# EAGLE schematic cansat_vehicle (EAGLE 7.1.0)
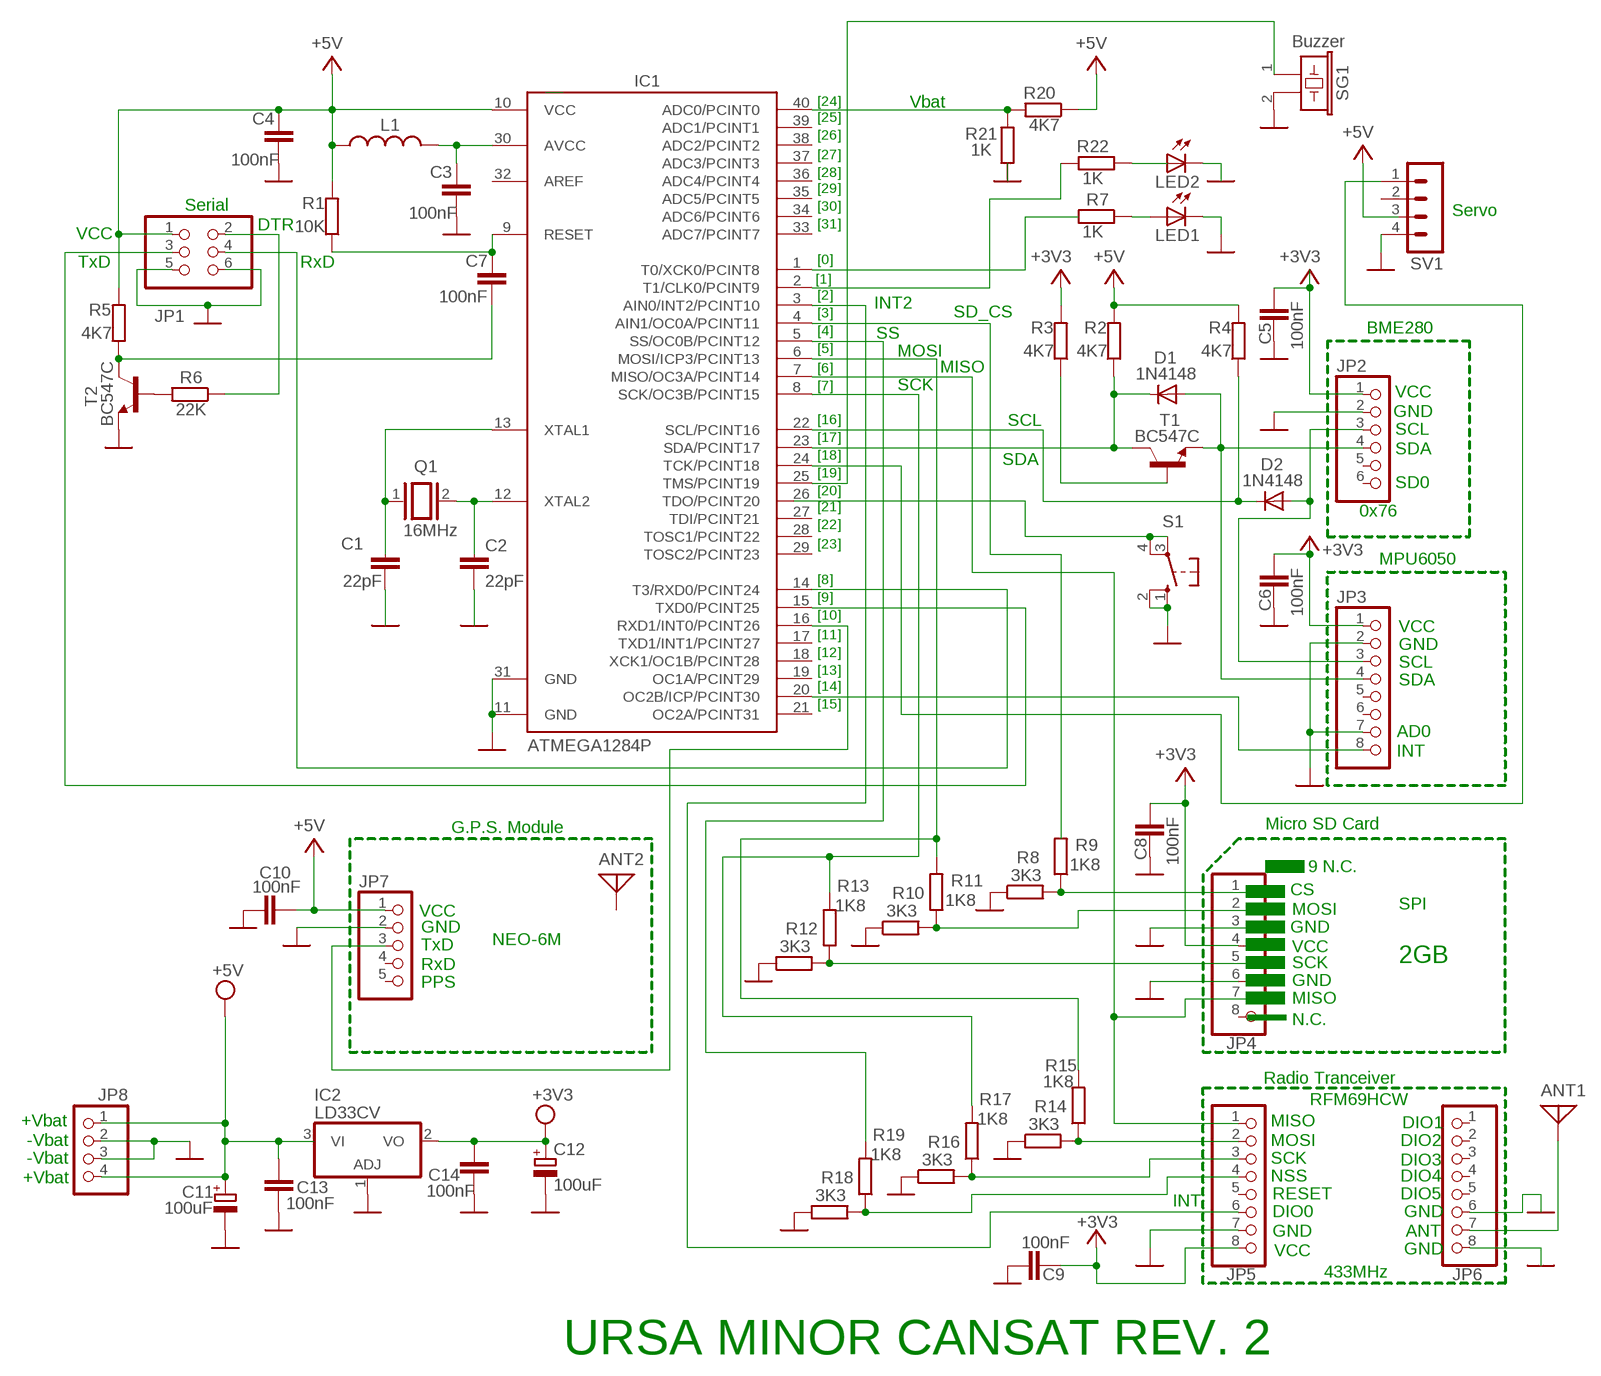
[diagram p0: schematic, sheet 1]

## Parts
ANT1  ANTENNA  [PAD-01]
ANT2  ANTENNA  [PAD-01]
C1  22pF  C2.5/2  [C2.5-2]
C2  22pF  C2.5/2  [C2.5-2]
C3  100nF  C2.5/2  [C2.5-2]
C4  100nF  C2.5/2  [C2.5-2]
C5  100nF  C2.5/2  [C2.5-2]
C6  100nF  C2.5/2  [C2.5-2]
C7  100nF  C2.5/2  [C2.5-2]
C8  100nF  C2.5/2  [C2.5-2]
C9  100nF  C2.5/2  [C2.5-2]
C10  100nF  C2.5/2  [C2.5-2]
C11  100uF  CPOL-EUE2.5-7  [E2,5-7]
C12  100uF  CPOL-EUE2.5-7  [E2,5-7]
C13  100nF  C2.5/2  [C2.5-2]
C14  100nF  C2.5/2  [C2.5-2]
D1  1N4148  1N4148DO35-10  [DO35-10]
D2  1N4148  1N4148DO35-10  [DO35-10]
IC1  ATMEGA1284P  MEGA1284P  [DIL40]
IC2  LD33CV  317T  [TO220H]
JP1  PINHD-2X3  [2X03]
JP2  PINHD-1X6  [1X06]
JP3  PINHD-1X8  [1X08]
JP4  PINHD-1X8  [1X08]
JP5  PINHD-1X8  [1X08]
JP6  PINHD-1X8  [1X08]
JP7  PINHD-1X5  [1X05]
JP8  PINHD-1X4  [1X04]
L1  L-US0204/5  [0204/5]
LED1  LED3MM  [LED3MM]
LED2  LED3MM  [LED3MM]
Q1  16MHz  XTAL  [Q]
R1  10K  R-EU_0204_2V  [0204V]
R2  4K7  R-EU_0204_2V  [0204V]
R3  4K7  R-EU_0204_2V  [0204V]
R4  4K7  R-EU_0204_2V  [0204V]
R5  4K7  R-EU_0204_2V  [0204V]
R6  22K  R-EU_0204_2V  [0204V]
R7  1K  R-EU_0204_2V  [0204V]
R8  3K3  R-EU_0204_2V  [0204V]
R9  1K8  R-EU_0204_2V  [0204V]
R10  3K3  R-EU_0204_2V  [0204V]
R11  1K8  R-EU_0204_2V  [0204V]
R12  3K3  R-EU_0204_2V  [0204V]
R13  1K8  R-EU_0204_2V  [0204V]
R14  3K3  R-EU_0204_2V  [0204V]
R15  1K8  R-EU_0204_2V  [0204V]
R16  3K3  R-EU_0204_2V  [0204V]
R17  1K8  R-EU_0204_2V  [0204V]
R18  3K3  R-EU_0204_2V  [0204V]
R19  1K8  R-EU_0204_2V  [0204V]
R20  4K7  R-EU_0204_2V  [0204V]
R21  1K  R-EU_0204_2V  [0204V]
R22  1K  R-EU_0204_2V  [0204V]
S1  10-XX  [B3F-10XX]
SG1  Buzzer  B/C11L  [B/C11L]
SV1  MA04-1  [MA04-1]
T1  BC547C  BC547B-NPN-TO92-CBE  [TO92-CBE]
T2  BC547C  BC547B-NPN-TO92-CBE  [TO92-CBE]

## Nets
GND: C3.2 C4.2 C5.2 C6.2 C8.2 C9.1 C10.2 C11.- C12.- C13.2 C14.2 IC1.11(GND) IC1.31(GND) IC2.1(ADJ) JP1.5 JP1.6 JP2.2 JP3.2 JP3.7 JP4.6 JP5.7 JP7.2 JP8.2 JP8.3 LED1.K(C) R8.1 R10.1 R12.1 R14.1 R16.1 R18.1 R21.1 S1.1(S) S1.2(S1) SG1.2 SV1.4 T2.E
N$1: IC1.13(XTAL1) Q1.1
N$2: IC1.12(XTAL2) Q1.2
N$4: C1.2
N$5: C2.2
N$6: C3.1 IC1.30(AVCC) L1.2
N$7: D1.C IC1.23(SDA/PCINT17) R2.1 T1.C
N$8: C7.1 IC1.9(RESET) R1.1
N$9: D1.A JP2.4 JP3.4 T1.E
N$10: R3.1 T1.B
N$12: D2.C IC1.22(SCL/PCINT16) R4.1
N$14: D2.A JP2.3 JP3.3
N$15: IC1.20(OC2B/ICP/PCINT30) JP3.8
N$16: R8.2 R9.1
N$17: IC1.4(AIN1/OC0A/PCINT11)
N$18: R10.2 R11.1
N$19: C7.2 R5.1 T2.C
N$20: R6.2 T2.B
N$21: JP1.2 R6.1
N$22: IC1.15(TXD0/PCINT25) JP1.3
N$23: IC1.14(T3/RXD0/PCINT24) JP1.4
N$24: IC1.1(T0/XCK0/PCINT8) R7.2
N$25: LED1.A R7.1
N$27: IC1.6(MOSI/ICP3/PCINT13) R11.2 R15.2
N$29: R12.2 R13.1
N$30: IC1.8(SCK/OC3B/PCINT15) R13.2 R17.2
N$31: IC1.7(MISO/OC3A/PCINT14) JP5.1
N$32: ANT1.1 JP6.7
N$33: JP5.2 R14.2 R15.1
N$34: JP5.3 R16.2 R17.1
N$35: IC1.2(T1/CLK0/PCINT9) R22.2
N$37: IC1.5(SS/OC0B/PCINT12) R19.2
N$38: JP6.8
N$39: JP6.6
N$40: IC1.3(AIN0/INT2/PCINT10) JP5.6
N$41: JP5.4 R18.2 R19.1
N$42: IC1.16(RXD1/INT0/PCINT26) JP7.3
N$43: R22.1
N$44: LED2.K(C)
N$45: IC1.40(ADC0/PCINT0) R20.2 R21.2
N$46: IC1.25(TMS/PCINT19)
N$47: S1.3(P) S1.4(P1)
N$48: IC1.24(TCK/PCINT18) SV1.1
VCC: C4.1 C5.1 C6.1 C8.1 C9.2 C10.1 C11.+ C12.+ C13.1 C14.1 IC1.10(VCC) IC2.2(VO) JP1.1 JP2.1 JP3.1 JP4.4 JP5.8 JP7.1 JP8.1 JP8.4 L1.1 R1.2 R2.2 R3.2 R4.2 R5.2 R20.1 ; supply symbol labelled +5V, +3V3
Unconnected: ANT2.1 C1.1 C2.1 IC1.17(TXD1/INT1/PCINT27) IC1.18(XCK1/OC1B/PCINT28) IC1.19(OC1A/PCINT29) IC1.21(OC2A/PCINT31) IC1.26(TDO/PCINT20) IC1.27(TDI/PCINT21) IC1.28(TOSC1/PCINT22) IC1.29(TOSC2/PCINT23) IC1.32(AREF) IC1.33(ADC7/PCINT7) IC1.34(ADC6/PCINT6) IC1.35(ADC5/PCINT5) IC1.36(ADC4/PCINT4) IC1.37(ADC3/PCINT3) IC1.38(ADC2/PCINT2) IC1.39(ADC1/PCINT1) IC2.3(VI) JP2.5 JP2.6 JP3.5 JP3.6 JP4.1 JP4.2 JP4.3 JP4.5 JP4.7 JP4.8 JP5.5 JP6.1 JP6.2 JP6.3 JP6.4 JP6.5 JP7.4 JP7.5 LED2.A R9.2 SG1.1 SV1.2 SV1.3

## Notes on the sheet
- [24] | Vbat
- [25]
- [26]
- [27]
- [28]
- [29]
- Serial | [30]
- Servo
- DTR | [31]
- VCC
- TxD | RxD | [0]
- [1]
- [2]
- INT2 | SD_CS
- [3]
- [4] | BME280
- SS
- [5] | MOSI
- [6] | MISO
- [7] | SCK
- VCC
- GND
- [16] | SCL
- SCL
- [17]
- SDA
- [18]
- SDA
- [19]
- SD0
- [20]
- [21]
- 0x76
- [22]
- [23]
- MPU6050
- [8]
- [9]
- [10]
- VCC
- [11]
- GND
- [12]
- SCL
- [13]
- SDA
- [14]
- [15]
- AD0
- INT
- G.P.S. Module | Micro SD Card
- 9 N.C.
- CS
- SPI
- VCC | MOSI
- GND | GND
- NEO-6M
- TxD | VCC
- 2GB
- RxD | SCK
- PPS | GND
- MISO
- N.C.
- Radio Tranceiver
- RFM69HCW
- +Vbat | MISO | DIO1
- -Vbat | MOSI | DIO2
- -Vbat | SCK | DIO3
- +Vbat | NSS | DIO4
- RESET | DIO5
- INT
- DIO0 | GND
- GND | ANT
- VCC | GND
- 433MHz
- URSA MINOR CANSAT REV. 2

## Library data of the parts
ANT1 ANT2 = discrete:ANTENNA: Antenna
C1-C10 C13 C14 = capacitor-wima:C: CAPACITOR naming: grid - package width
C11 C12 = rcl:CPOL-EU: POLARIZED CAPACITOR, European symbol
D1 D2 = diode:1N4148: DIODE high speed (Philips)
IC1 = 1284p:MEGA1284P: Atmel ATmega1284P 8-bit AVR Microcontroller
IC2 = linear:*317: Positive VOLTAGE REGULATOR
JP1 = pinhead:PINHD-2X3: PIN HEADER
JP2 = pinhead:PINHD-1X6: PIN HEADER
JP3-JP6 = pinhead:PINHD-1X8: PIN HEADER
JP7 = pinhead:PINHD-1X5: PIN HEADER
JP8 = pinhead:PINHD-1X4: PIN HEADER
L1 = rcl:L-US: INDUCTOR, American symbol
LED1 LED2 = led:LED: LED OSRAM: - CHIPLED LG R971, LG N971, LY N971, LG Q971, LY Q971, LO R971, LY R971 LH N974, LH R974 LS Q976, LO Q976, LY Q976 LO Q996 - Hyper CHIPLED LW Q18S LB Q993, LB Q99A, LB R99A - SideLED LS A670, LO A670, LY A670, LG A670, LP A670 LB A673, LV A673, LT A673, LW A673 LH A674 LY A675 LS A676, LA A676, LO A676, LY A676, LW A676 LS A679, LY A679, LG A679 - Hyper Micro SIDELED® LS Y876, LA Y876, LO Y876, LY Y876 LT Y87S - SmartLED LW L88C, LW L88S LB L89C, LB L89S, LG L890 LS L89K, LO L89K, LY L89K LS L896, LA L896, LO L896, LY L896 - TOPLED LS T670, LO T670, LY T670, LG T670, LP T670 LSG T670, LSP T670, LSY T670, LOP T670, LYG T670 LG T671, LOG T671, LSG T671 LB T673, LV T673, LT T673, LW T673 LH T674 LS T676, LA T676, LO T676, LY T676, LB T676, LH T676, LSB T676, LW T676 LB T67C, LV T67C, LT T67C, LS T67K, LO T67K, LY T67K, LW E67C LS E67B, LA E67B, LO E67B, LY E67B, LB E67C, LV E67C, LT E67C LW T67C LS T679, LY T679, LG T679 LS T770, LO T770, LY T770, LG T770, LP T770 LB T773, LV T773, LT T773, LW T773 LH T774 LS E675, LA E675, LY E675, LS T675 LS T776, LA T776, LO T776, LY T776, LB T776 LHGB T686 LT T68C, LB T68C - Hyper Mini TOPLED® LB M676 - Mini TOPLED Santana® LG M470 LS M47K, LO M47K, LY M47K Source: http://www.osram.convergy.de LUXEON: - LUMILED® LXK2-PW12-R00, LXK2-PW12-S00, LXK2-PW14-U00, LXK2-PW14-V00 LXK2-PM12-R00, LXK2-PM12-S00, LXK2-PM14-U00 LXK2-PE12-Q00, LXK2-PE12-R00, LXK2-PE12-S00, LXK2-PE14-T00, LXK2-PE14-U00 LXK2-PB12-K00, LXK2-PB12-L00, LXK2-PB12-M00, LXK2-PB14-N00, LXK2-PB14-P00, LXK2-PB14-Q00 LXK2-PR12-L00, LXK2-PR12-M00, LXK2-PR14-Q00, LXK2-PR14-R00 LXK2-PD12-Q00, LXK2-PD12-R00, LXK2-PD12-S00 LXK2-PH12-R00, LXK2-PH12-S00 LXK2-PL12-P00, LXK2-PL12-Q00, LXK2-PL12-R00 Source: www.luxeon.com KINGBRIGHT: KA-3528ASYC Source: www.kingbright.com
Q1 = special:XTAL: CRYSTAL
R1-R22 = resistor:R-EU_: RESISTOR, European symbol; SPICEPREFIX: R
S1 = switch-omron:10-XX: OMRON SWITCH; MPN: B3F-1000; OC_FARNELL: 176432; OC_NEWARK: 36M3542
SG1 = buzzer:B/C11L: BUZZER Source: Buerklin; OC_FARNELL: unknown; OC_NEWARK: unknown
SV1 = con-lstb:MA04-1: PIN HEADER; OC_FARNELL: unknown; OC_NEWARK: unknown
T1 T2 = transistor:*-NPN-: NPN Transistror BF959 corrected 2008.03.06